# EAGLE design DC Motor Speed Control (EAGLE 6.5.0)
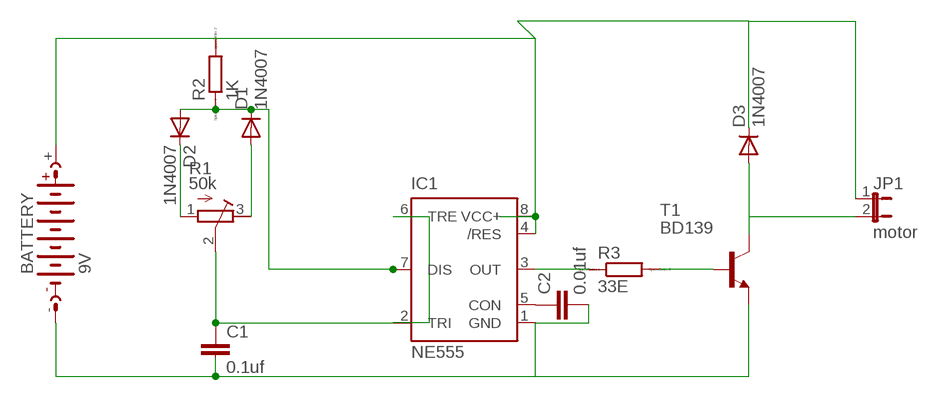
[diagram p0: schematic, sheet 1]

## Parts
BATTERY  9V  AB9V  [AB9V]
C1  0.1uf  C2.5/4  [C2.5-4]
C2  0.01uf  C2.5/4  [C2.5-4]
D1  1N4007  1N4004  [DO41-10]
D2  1N4007  1N4004  [DO41-10]
D3  1N4007  1N4004  [DO41-10]
IC1  NE555  [DIL-08]
JP1  motor  JP1E  [JP1]
R1  50k  R-TRIMM64P  [RTRIM64P]
R2  1K  R0204/7  [0204/7]
R3  33E  R0204/7  [0204/7]
T1  BD139  [TO126]

## Nets
N$1: R3.2 T1.3(B)
N$2: C1.1 IC1.2(TRI) IC1.6(TRE) R1.2(S)
N$3: D1.C D2.A IC1.7(DIS) R2.1
N$4: BATTERY.+ D3.C IC1.4(/RES) IC1.8(VCC+) JP1.1 R2.2
N$5: D2.C R1.1(E)
N$6: D1.A R1.3(A)
N$7: C2.1 IC1.5(CON)
N$8: BATTERY.- C1.2 C2.2 IC1.1(GND) T1.1(E)
N$9: IC1.3(OUT) R3.1
N$10: D3.A JP1.2 T1.2(C)

## Library data of the parts
BATTERY = battery:AB9V: 9-V BATTERY CLIP
C1 C2 = capacitor-wima:C: CAPACITOR naming: grid - package width
D1-D3 = diode:1N4004: DIODE general purpose rectifier, 1 A
IC1 = st-microelectronics:NE555: General purpose bipolar Timer; MF: Arrow Electronics; MPN: NE555N; OC_FARNELL: 1467742; OC_NEWARK: 89K1486
JP1 = jumper:JP1E: JUMPER
R1 = resistor:R-TRIMM: Trimm resistor
R2 R3 = eagle-ltspice:R: RESISTOR, European symbol; SPICEMODEL: NONE; SPICEPREFIX: R
T1 = transistor:BD139: NPN TRANSISTOR

## Board
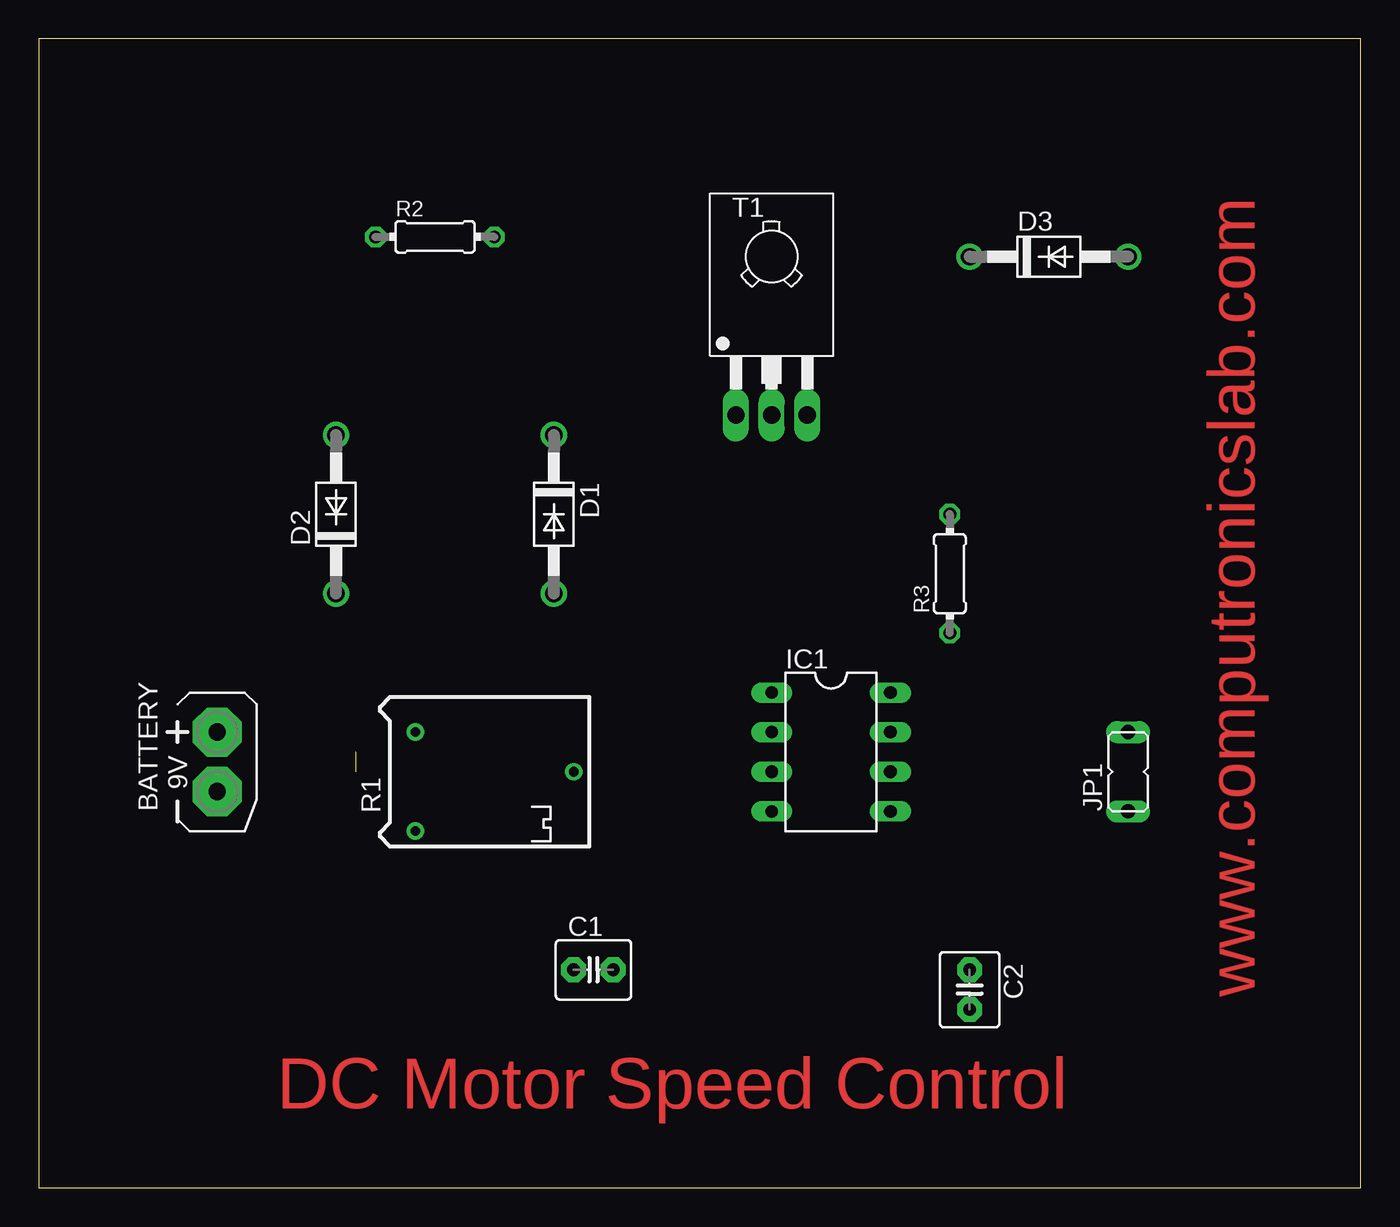
[diagram p1: board, top side]
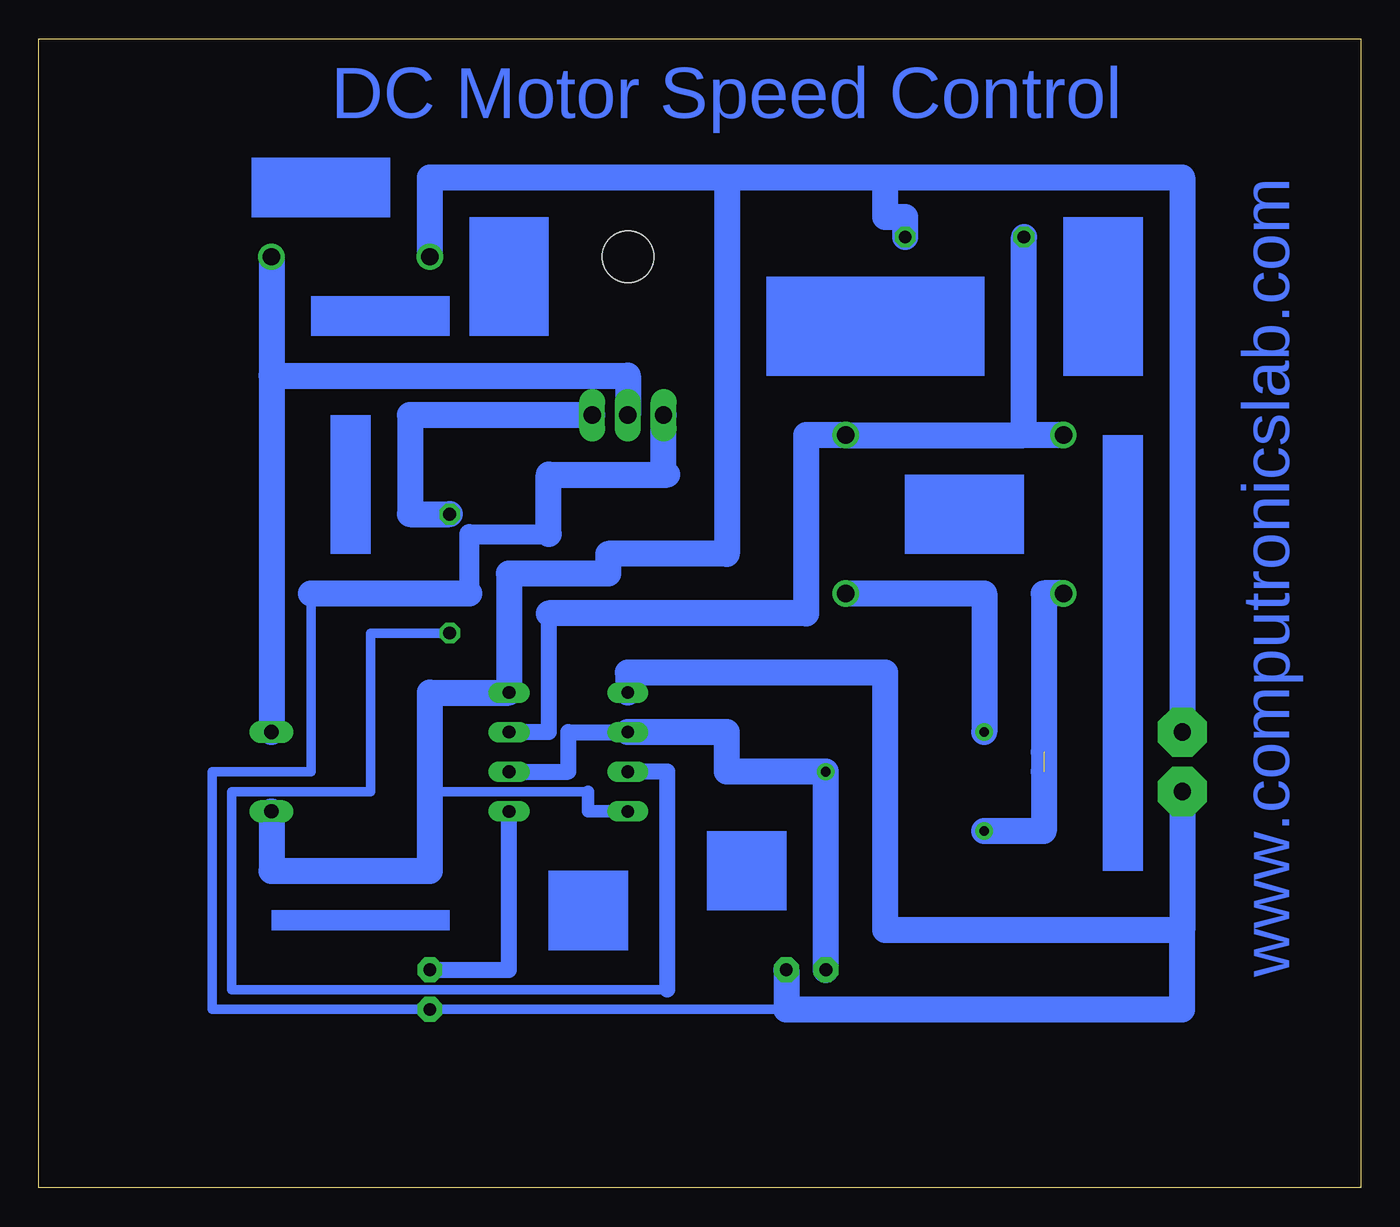
[diagram p2: board, bottom side, seen from below]

Size 84.76 x 73.65 mm. Coordinates in mm from the lower left corner, seen from the top.
Outline: 0,0 84.76,0 84.76,73.65 0,73.65 0,0
Copper layers (1*16): Top 0.035mm / dielectric 1.5mm / Bottom 0.035mm
Design rules "default": minimum track width 10mil, minimum drill 24mil, track to track 8mil, track to pad 8mil, pad to pad 8mil, via to via 8mil, smd to smd 8mil, copper to edge 40mil, drill to drill 8mil, minimum pad ring 10mil, minimum via ring 8mil, stop-mask expansion 4mil, vias tented up to drill 0mil, thermal gap 10mil

### Footprints (pad centres in the part's own frame; a part is rotated, then mirrored left to right if it is on the bottom)
AB9V = drill 1.118 pad 3.15 octagon: + 0,2.54; - 0,-1.27
C2.5-4 = drill 0.813 pad 1.6 octagon: 1 -1.27,0; 2 1.27,0
DO41-10 = drill 1.118: A 5.08,0; C -5.08,0
DIL-08 = drill 0.813 long: 1 -3.81,-3.81; 2 -1.27,-3.81; 3 1.27,-3.81; 4 3.81,-3.81; 5 3.81,3.81; 6 1.27,3.81; 7 -1.27,3.81; 8 -3.81,3.81
JP1 = drill 0.914 long: 1 0,-2.54; 2 0,2.54
RTRIM64P = drill 0.61: 1 -2.54,-3.81; 2 7.62,0; 3 -2.54,2.54
0204/7 = drill 0.813 octagon: 1 -3.81,0; 2 3.81,0
TO126 = drill 1.118 long: 1 -2.286,-5.08; 2 0,-5.08; 3 2.286,-5.08 | hole 3.302: 0,5.08

### Placement (x,y rotation side)
BATTERY  11.43,26.67 0 top
C1  35.56,13.97 0 top
C2  59.69,12.7 270 top
D1  33.02,43.18 270 top
D2  19.05,43.18 90 top
D3  64.77,59.69 0 top
IC1  50.8,27.94 270 top
JP1  69.85,26.67 0 top
R1  26.67,26.67 0 top
R2  25.4,60.96 0 top
R3  58.42,39.37 90 top
T1  46.99,54.61 0 top

### Tracks (layer width: path | path; a pad name or v marks a point on that pad's centre or on a via)
N$1
  Bottom 1.676: T1.3 60.96,49.53 60.96,43.18 R3.2
N$2
  Bottom 1.016: IC1.2 50.8,29.21 50.8,26.67 IC1.6
  Bottom 1.676: C1.1 R1.2 40.64,26.67 40.64,29.21 IC1.2
N$3
  Bottom 1.016: 52.07,36.83 52.07,29.21 IC1.7
  Bottom 1.676: 21.59,48.26 R2.1 | D2.A 21.59,48.26 | 52.07,36.83 35.56,36.83 35.56,48.26 D1.C 21.59,48.26
N$4
  Bottom 0.61: 59.69,25.4 49.53,25.4
  Bottom 0.813: 49.53,25.4 49.53,24.13 IC1.4
  Bottom 1.676: JP1.1 69.85,20.32 59.69,20.32 59.69,24.13 59.69,25.4 59.69,31.75 IC1.8 54.61,39.37 48.26,39.37 48.26,40.64 40.64,40.64 40.64,64.77 | R2.2 29.21,62.23 30.48,62.23 30.48,64.77 | 40.64,64.77 59.69,64.77 D3.C | 40.64,64.77 30.48,64.77 | BATTERY.+ 11.43,64.77 30.48,64.77
N$5  (1 unrouted)
  Bottom 1.676: 20.32,27.94 20.32,22.86 R1.1 | 20.32,26.67 20.32,38.1 D2.C
N$6
  Bottom 1.676: D1.A 24.13,38.1 R1.3
N$7
  Bottom 1.016: IC1.5 54.61,13.97 C2.1
N$8
  Bottom 0.254: 44.45,45.72 44.45,49.53 T1.1
  Bottom 0.406: 44.45,45.72 44.7,45.72
  Bottom 0.61: 36.83,11.43 C2.2 73.66,11.43 73.66,26.67 67.31,26.67 67.31,38.1
  Bottom 1.27: 57.15,38.1 57.15,41.91 52.07,41.91
  Bottom 1.676: IC1.1 46.99,33.02 30.48,33.02 30.48,16.51 11.43,16.51 | BATTERY.- 11.43,16.51 | 67.31,38.1 57.15,38.1 | 52.07,41.91 52.07,45.72 44.45,45.72 | 11.43,16.51 11.43,11.43 36.83,11.43 C1.2 | 44.7,45.72 T1.1
N$9
  Bottom 0.61: 44.45,12.7 72.39,12.7 72.39,25.4 63.5,25.4 63.5,35.56 R3.1
  Bottom 1.016: IC1.3 44.45,26.67 44.45,12.7
N$10
  Bottom 1.676: D3.A 69.85,52.07 | 69.85,52.07 JP1.2 | T1.2 46.99,52.07 69.85,52.07
(copper drawn outside any net)
  shapes: Bottom area x11

### Text on the board
Top: www.computronicslab.com | DC Motor Speed Control
Bottom: DC Motor Speed Control | www.computronicslab.com